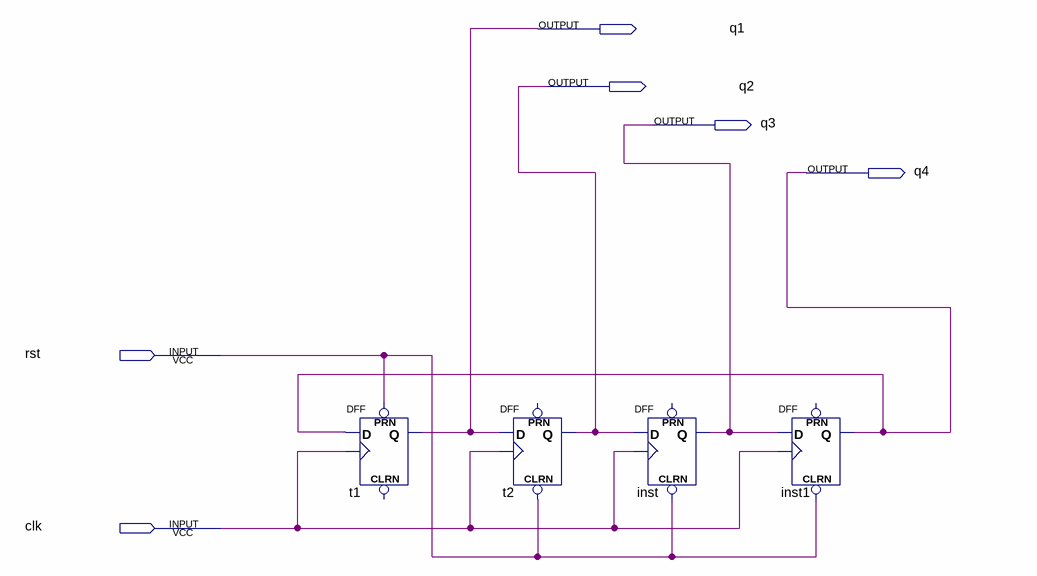
[diagram p0: schematic sheet]
// Quartus schematic pcp.bdf as structural Verilog: 4 symbols, 6 pins
module pcp (
  input  rst,
  input  clk,
  output q1,
  output q2,
  output q3,
  output q4
);

  DFF t1 (.CLK(clk), .D(q4), .PRN(rst), .Q(q1));  // open: CLRN
  DFF t2 (.CLRN(rst), .CLK(clk), .D(q1), .Q(q2));  // open: PRN
  DFF inst (.CLRN(rst), .CLK(clk), .D(q2), .Q(q3));  // open: PRN
  DFF inst1 (.CLRN(rst), .CLK(clk), .D(q3), .Q(q4));  // open: PRN
endmodule
